# Altium schematic sheet Led.SchDoc
size A4; SheetNumber: 1; SheetTotal: 1
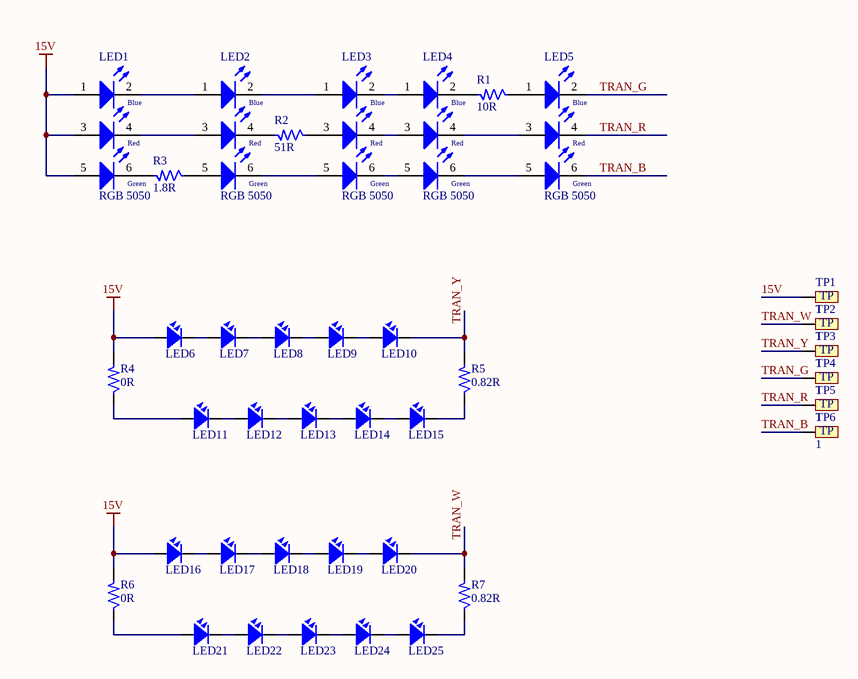
[diagram p0: Led.SchDoc]

## Parts
LED1  RGB 5050  [LED RGB 5050]
LED2  RGB 5050  [LED RGB 5050]
LED3  RGB 5050  [LED RGB 5050]
LED4  RGB 5050  [LED RGB 5050]
LED5  RGB 5050  [LED RGB 5050]
LED6  3030  [LED 3030]  (value not drawn)
LED7  3030  [LED 3030]  (value not drawn)
LED8  3030  [LED 3030]  (value not drawn)
LED9  3030  [LED 3030]  (value not drawn)
LED10  3030  [LED 3030]  (value not drawn)
LED11  3030  [LED 3030]  (value not drawn)
LED12  3030  [LED 3030]  (value not drawn)
LED13  3030  [LED 3030]  (value not drawn)
LED14  3030  [LED 3030]  (value not drawn)
LED15  3030  [LED 3030]  (value not drawn)
LED16  3030  [LED 3030]  (value not drawn)
LED17  3030  [LED 3030]  (value not drawn)
LED18  3030  [LED 3030]  (value not drawn)
LED19  3030  [LED 3030]  (value not drawn)
LED20  3030  [LED 3030]  (value not drawn)
LED21  3030  [LED 3030]  (value not drawn)
LED22  3030  [LED 3030]  (value not drawn)
LED23  3030  [LED 3030]  (value not drawn)
LED24  3030  [LED 3030]  (value not drawn)
LED25  3030  [LED 3030]  (value not drawn)
R1  10R  [SM-RES-1206]
R2  51R  [SM-RES-1206]
R3  1.8R  [SM-RES-1206]
R4  0R  [SM-RES-1206]
R5  0.82R  [SM-RES-1206]
R6  0R  [SM-RES-1206]
R7  0.82R  [SM-RES-1206]
TP1  1  [TP]
TP2  1  [TP]
TP3  1  [TP]
TP4  1  [TP]
TP5  1  [TP]
TP6  1  [TP]

## Nets
15V: LED1.1 LED1.3 LED1.5 LED6.1 LED16.1 R4.2 R6.2 TP1.TP1
TRAN_B: LED5.6 TP6.TP1
TRAN_G: LED5.2 TP4.TP1
TRAN_R: LED5.4 TP5.TP1
TRAN_W: LED20.2 R7.2 TP2.TP1
TRAN_Y: LED10.2 R5.2 TP3.TP1
NetLED1_2: LED1.2 LED2.1
NetLED1_4: LED1.4 LED2.3
NetLED1_6: LED1.6 R3.2
NetLED2_2: LED2.2 LED3.1
NetLED2_4: LED2.4 R2.2
NetLED2_5: LED2.5 R3.1
NetLED2_6: LED2.6 LED3.5
NetLED3_2: LED3.2 LED4.1
NetLED3_3: LED3.3 R2.1
NetLED3_4: LED3.4 LED4.3
NetLED3_6: LED3.6 LED4.5
NetLED4_2: LED4.2 R1.2
NetLED4_4: LED4.4 LED5.3
NetLED4_6: LED4.6 LED5.5
NetLED5_1: LED5.1 R1.1
NetLED6_2: LED6.2 LED7.1
NetLED7_2: LED7.2 LED8.1
NetLED8_2: LED8.2 LED9.1
NetLED9_2: LED9.2 LED10.1
NetLED11_1: LED11.1 R4.1
NetLED11_2: LED11.2 LED12.1
NetLED12_2: LED12.2 LED13.1
NetLED13_2: LED13.2 LED14.1
NetLED14_2: LED14.2 LED15.1
NetLED15_2: LED15.2 R5.1
NetLED16_2: LED16.2 LED17.1
NetLED17_2: LED17.2 LED18.1
NetLED18_2: LED18.2 LED19.1
NetLED19_2: LED19.2 LED20.1
NetLED21_1: LED21.1 R6.1
NetLED21_2: LED21.2 LED22.1
NetLED22_2: LED22.2 LED23.1
NetLED23_2: LED23.2 LED24.1
NetLED24_2: LED24.2 LED25.1
NetLED25_2: LED25.2 R7.1

## Notes on the sheet
- (in symbol LED RGB 5050 1.5W) Blue; Red; Green

## Library data of the parts
LED1-LED5 = LED RGB 5050 1.5W
LED6-LED25 = LED SMD: Value: LED 3 - 5 ly 2 Colour
R1-R7 = R: Resistor 1/4W; Value: R1/4W - 1K
TP1-TP6 = TP: CONNECT 1